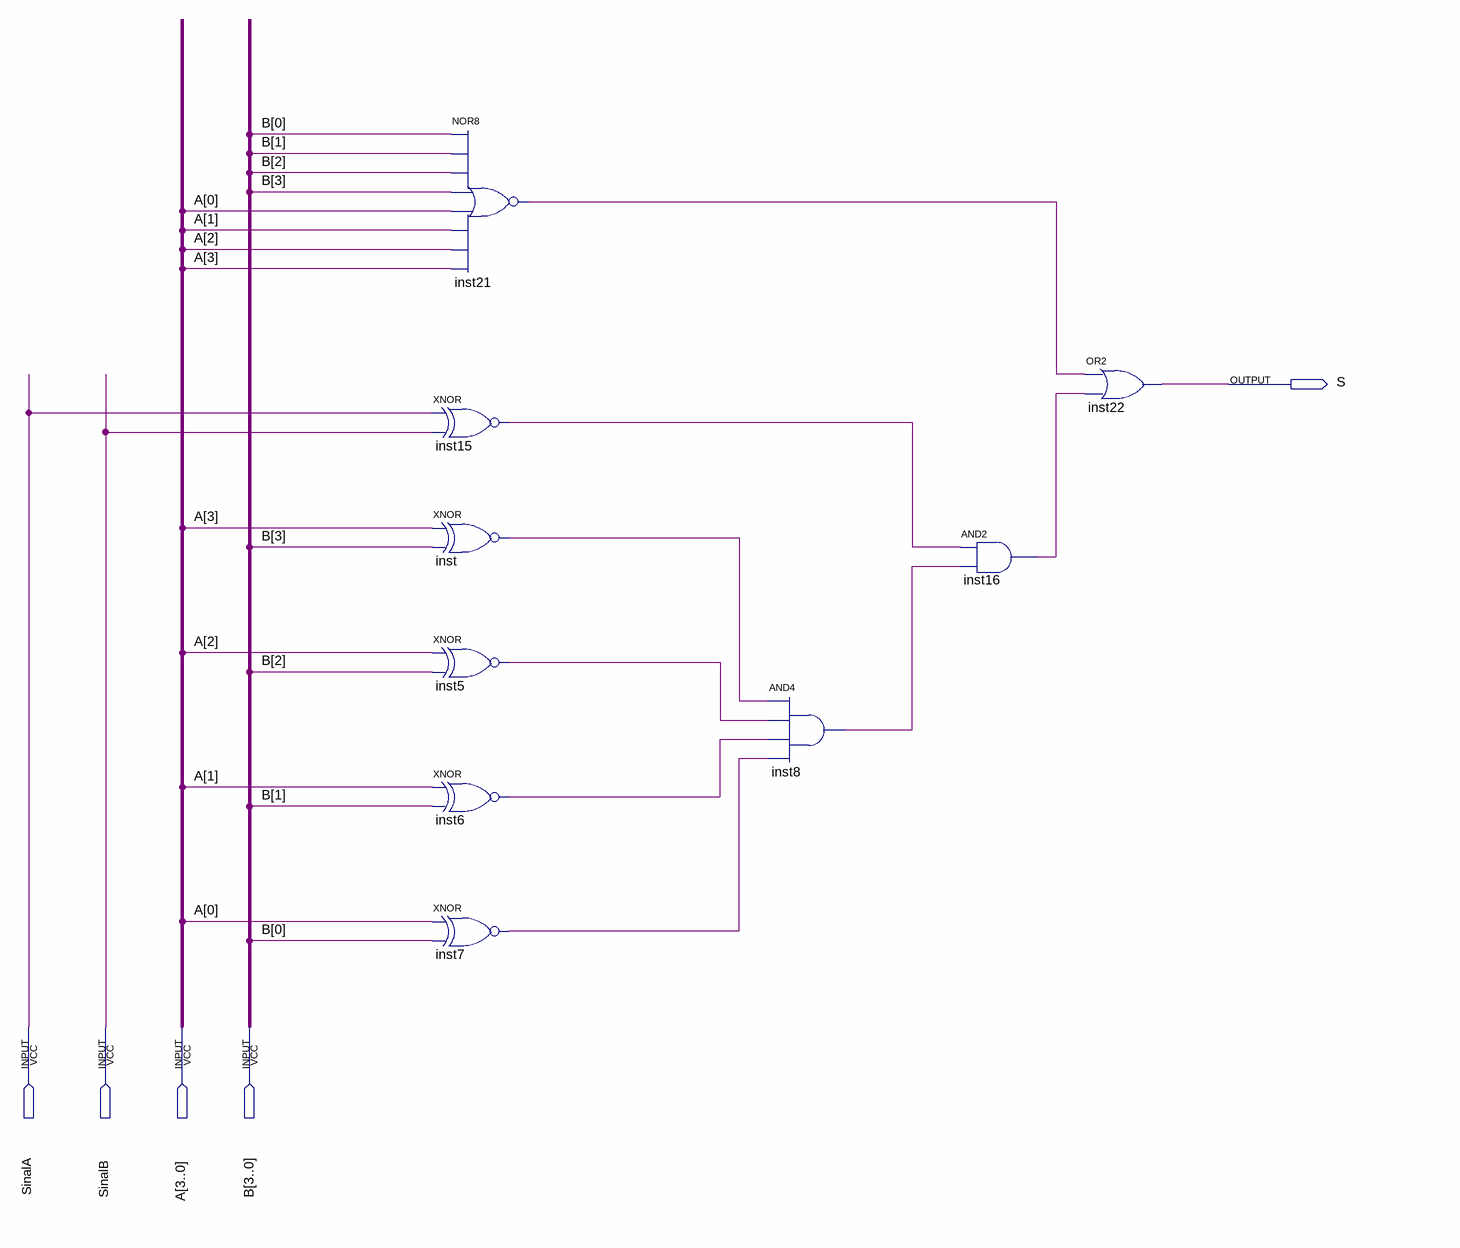
[diagram p0: schematic sheet]
// Quartus schematic AigualB.bdf as structural Verilog: 9 symbols, 5 pins
module AigualB (
  input  SinalA,
  input  SinalB,
  input  [3:0] A,
  input  [3:0] B,
  output S
);

  wire inst5_out, inst6_out, inst7_out, inst8_out, inst15_out, inst16_out, inst21_out, inst_out;

  nor inst21 (inst21_out, B[0], B[1], B[2], B[3], A[0], A[1], A[2], A[3]);
  xnor inst15 (inst15_out, SinalA, SinalB);
  xnor inst (inst_out, A[3], B[3]);
  xnor inst5 (inst5_out, A[2], B[2]);
  xnor inst6 (inst6_out, A[1], B[1]);
  xnor inst7 (inst7_out, A[0], B[0]);
  and inst8 (inst8_out, inst_out, inst5_out, inst6_out, inst7_out);
  and inst16 (inst16_out, inst15_out, inst8_out);
  or inst22 (S, inst21_out, inst16_out);
endmodule
